# Altium schematic sheet MCU_Per.SchDoc
size A3
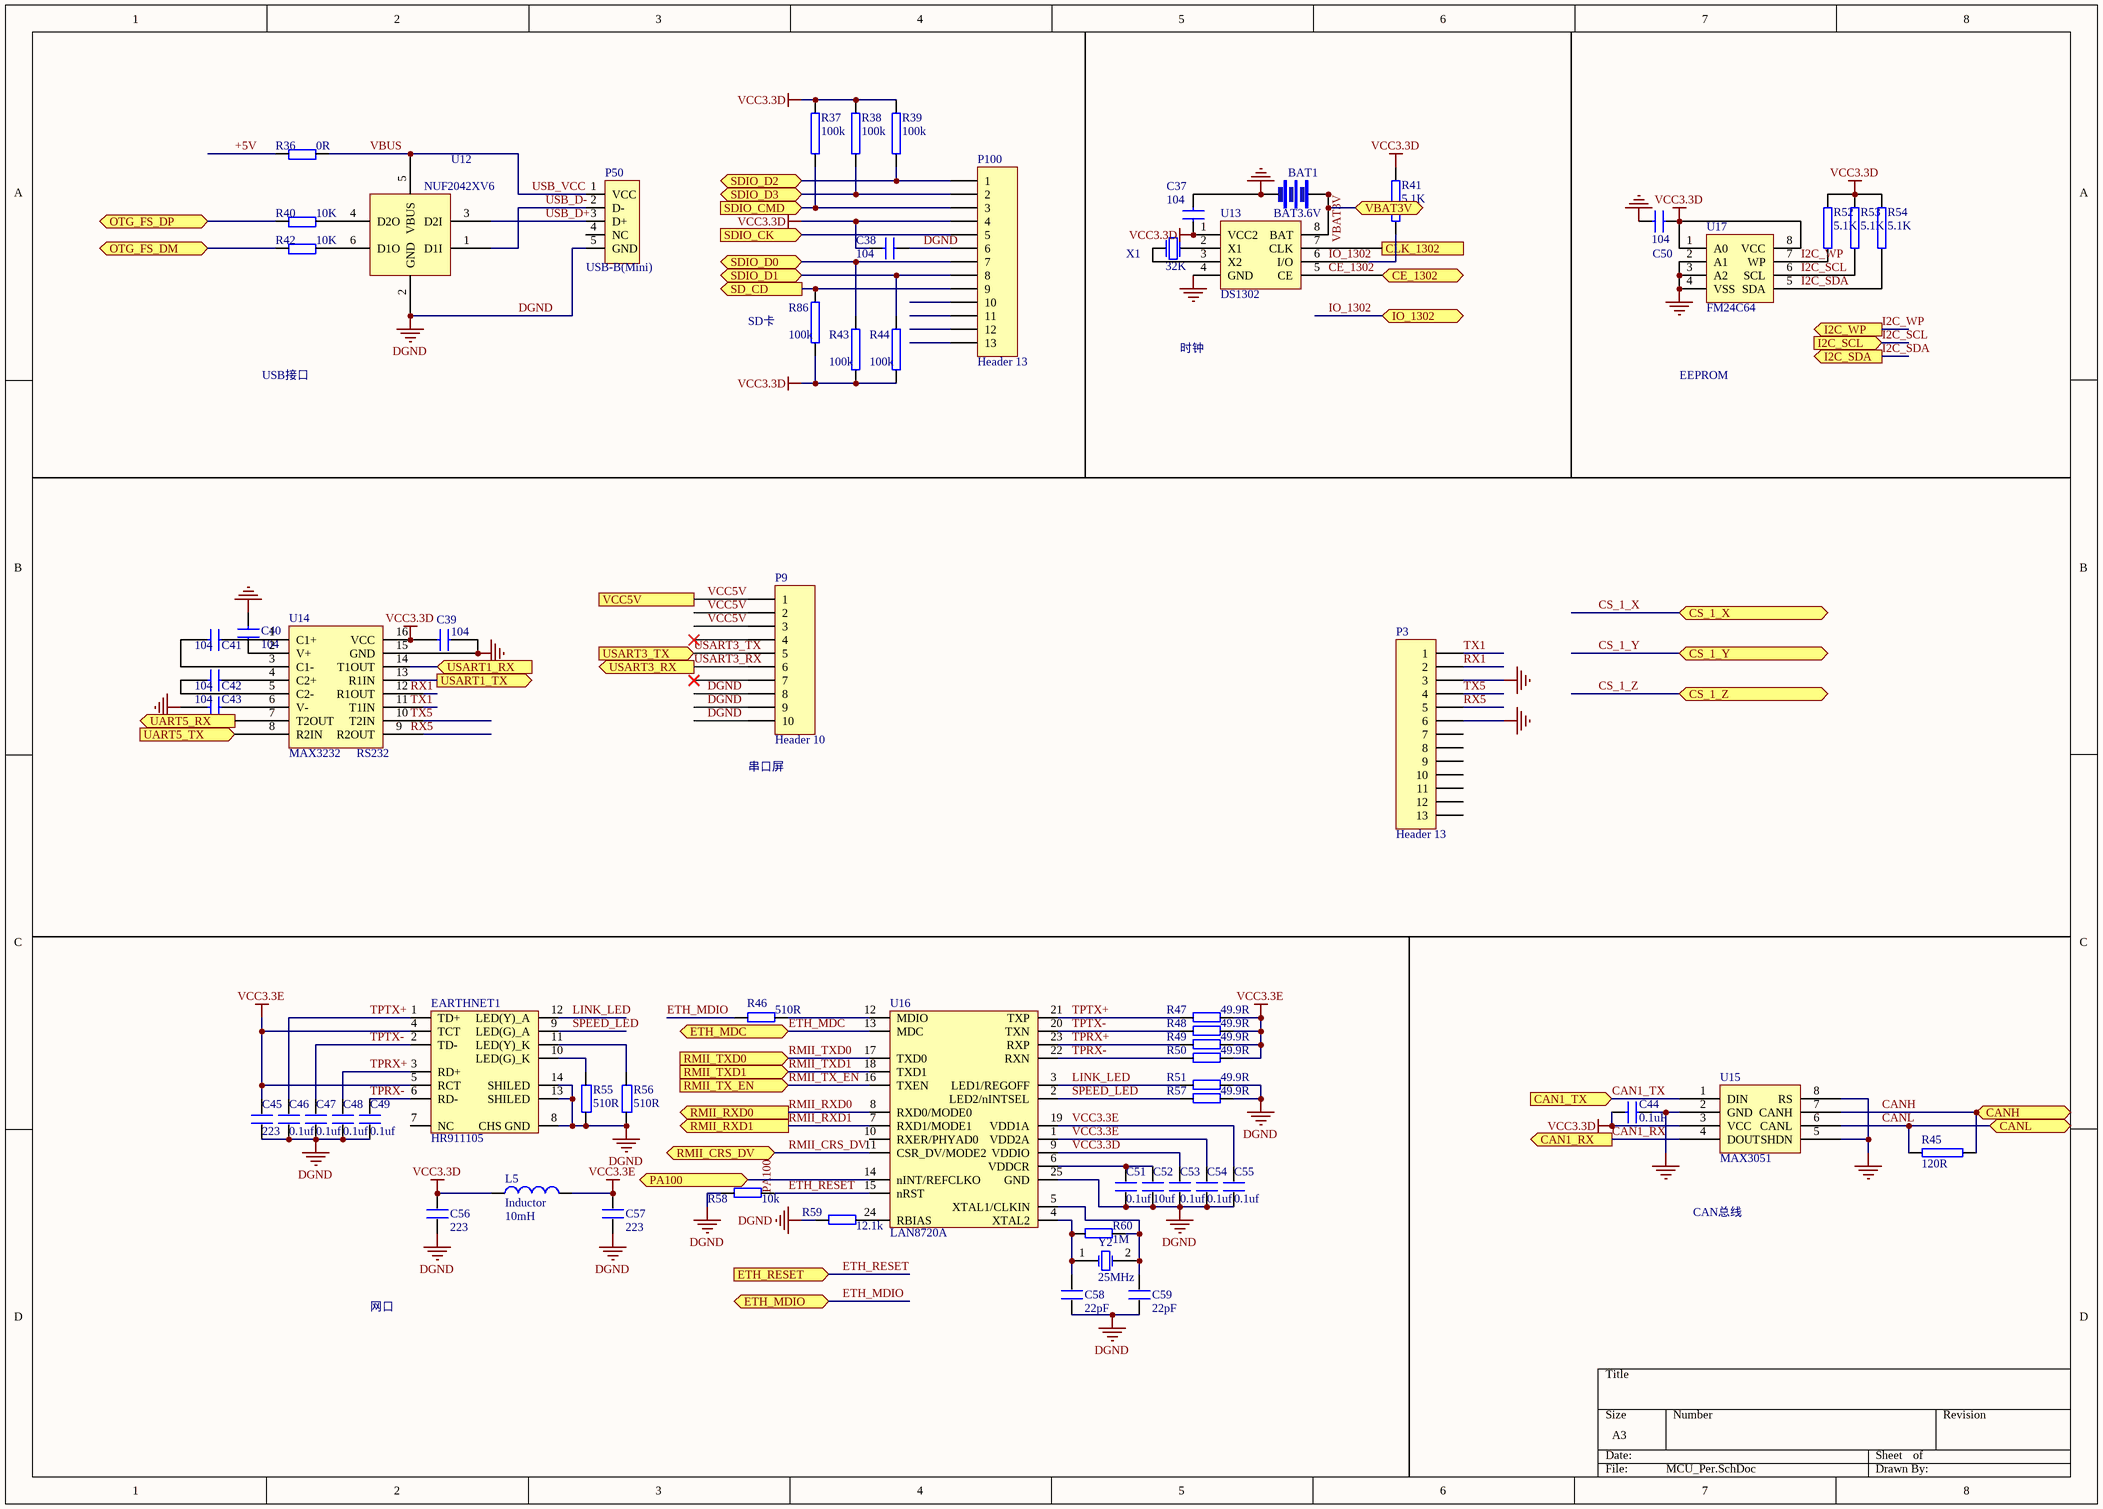
[diagram p0: MCU_Per.SchDoc]

## Parts
BAT1  BAT3.6V  [BAT]
C37  104  [0603]
C38  104  [0603]
C39  104  [0603]
C40  104  [0603]
C41  104  [0603]
C42  104  [0603]
C43  104  [0603]
C44  0.1uF  [0603]
C45  223  [0603P]
C46  0.1uf  [0603P]
C47  0.1uf  [0603P]
C48  0.1uf  [0603P]
C49  0.1uf  [0603P]
C50  104  [0603]
C51  0.1uf  [0603P]
C52  10uf  [0603P]
C53  0.1uf  [0603P]
C54  0.1uf  [0603P]
C55  0.1uf  [0603P]
C56  223  [0603P]
C57  223  [0603P]
C58  22pF  [0603P]
C59  22pF  [0603P]
EARTHNET1  HR911105  [HR911105A]
L5  Inductor  value 10mH  [0805]
P3  Header 13  [HDR1X6]
P9  Header 10  [PCBComponent_1]
P50  USB-B(Mini)  [USB/SM0.8-6H5]
P100  Header 13  [SD-SMT]
R36  0R  [0603P]
R37  100k  [0603]
R38  100k  [0603]
R39  100k  [0603]
R40  10K  [0603P]
R41  5.1K  [0603]
R42  10K  [0603P]
R43  100k  [0603]
R44  100k  [0603]
R45  120R  [0603]
R46  510R  [0603P]
R47  49.9R  [0603P]
R48  49.9R  [0603P]
R49  49.9R  [0603P]
R50  49.9R  [0603P]
R51  49.9R  [0603P]
R52  5.1K  [0603]
R53  5.1K  [0603]
R54  5.1K  [0603]
R55  510R  [0603P]
R56  510R  [0603P]
R57  49.9R  [0603P]
R58  10k  [0603P]
R59  12.1k  [0603P]
R60  1M  [0603P]
R86  100k  [0603]
U12  NUF2042XV6  [NUF2042XV6]
U13  DS1302  [SO-8]
U14  MAX3232  [SO-16]
U15  MAX3051  [SO-8]
U16  LAN8720A  [LAN7820A-QFN24]
U17  FM24C64  [SO-8]
X1  32K  [XTAL-2]
Y2  25MHz  [XTAL_US]

## Ports
CAN1_RX (out), CAN1_TX (in), CANH, CANL, CE_1302 (bidir), CLK_1302, CS_1_X, CS_1_Y, CS_1_Z, ETH_MDC (bidir), ETH_MDIO (bidir), ETH_RESET (in), I2C_SCL (in), I2C_SDA (out), I2C_WP (out), IO_1302 (bidir), OTG_FS_DM (bidir), OTG_FS_DP (bidir), PA100, RMII_CRS_DV (bidir), RMII_RXD0 (out), RMII_RXD1 (out), RMII_TX_EN (in), RMII_TXD0 (in), RMII_TXD1 (in), SD_CD (out), SDIO_CK (in), SDIO_CMD (in), SDIO_D0 (bidir), SDIO_D1 (bidir), SDIO_D2 (bidir), SDIO_D3 (bidir), UART5_RX (out), UART5_TX (in), USART1_RX (in), USART1_TX (out), USART3_RX (out), USART3_TX (in), VBAT3V, VCC5V

## Nets
DGND: BAT1.2 C37.1 C38.1 C39.1 C40.1 C43.2 C44.1 C45.2 C46.2 C47.2 C48.2 C49.2 C50.2 C51.2 C52.2 C53.2 C54.2 C55.2 C56.2 C57.2 C58.2 C59.2 EARTHNET1.8(CHS_GND) EARTHNET1.13(SHILED) EARTHNET1.14(SHILED) P3.3 P3.6 P9.8 P9.9 P9.10 P50.5(GND) P100.6 R51.1 R55.1 R56.1 R57.1 R58.2 R59.2 U12.2(GND) U13.4(GND) U14.15(GND) U15.2(GND) U15.5(SHDN) U15.8(RS) U16.25(GND) U17.2(A1) U17.3(A2) U17.4(VSS)
VCC3.3D: C37.2 C38.2 C39.2 C44.2 C50.1 C53.1 C56.1 L5.1 P100.4 R37.1 R38.1 R39.1 R41.2 R43.2 R44.2 R52.2 R53.2 R54.2 R86.2 U13.1(VCC2) U14.16(VCC) U15.3(VCC) U16.9(VDDIO) U17.1(A0) U17.8(VCC)
VCC3.3E: C45.1 C54.1 C55.1 C57.1 EARTHNET1.4(TCT) EARTHNET1.5(RCT) L5.2 R47.1 R48.1 R49.1 R50.1 U16.1(VDD2A) U16.19(VDD1A)
+5V: R36.1
CAN1_RX: U15.4(DOUT) ; port CAN1_RX
CAN1_TX: U15.1(DIN) ; port CAN1_TX
CANH: R45.1 U15.7(CANH) ; port CANH
CANL: R45.2 U15.6(CANL) ; port CANL
CE_1302: U13.5(CE) ; port CE_1302
CLK_1302: U13.7(CLK) ; port CLK_1302
CS_1_X: port CS_1_X
CS_1_Y: port CS_1_Y
CS_1_Z: port CS_1_Z
ETH_MDC: U16.13(MDC) ; port ETH_MDC
ETH_MDIO: R46.2 ; port ETH_MDIO
ETH_RESET: R58.1 U16.15(nRST) ; port ETH_RESET  [also labelled PA100]
I2C_SCL: R53.1 U17.6(SCL) ; port I2C_SCL
I2C_SDA: R54.1 U17.5(SDA) ; port I2C_SDA
I2C_WP: R52.1 U17.7(WP) ; port I2C_WP
IO_1302: R41.1 U13.6(I/O) ; port IO_1302
LINK_LED: EARTHNET1.12(LED(Y)_A) R51.2 U16.3(LED1/REGOFF)
OTG_FS_DM: R42.1 ; port OTG_FS_DM
OTG_FS_DP: R40.1 ; port OTG_FS_DP
PA100: U16.14(nINT/REFCLKO) ; port PA100
RMII_CRS_DV: U16.11(CSR_DV/MODE2) ; port RMII_CRS_DV
RMII_RXD0: U16.8(RXD0/MODE0) ; port RMII_RXD0
RMII_RXD1: U16.7(RXD1/MODE1) ; port RMII_RXD1
RMII_TX_EN: U16.16(TXEN) ; port RMII_TX_EN
RMII_TXD0: U16.17(TXD0) ; port RMII_TXD0
RMII_TXD1: U16.18(TXD1) ; port RMII_TXD1
RX1: P3.2 U14.12(R1OUT)
RX5: P3.5 U14.9(R2OUT)
SD_CD: P100.9 R86.1 ; port SD_CD
SDIO_CK: P100.5 ; port SDIO_CK
SDIO_CMD: P100.3 R37.2 ; port SDIO_CMD
SDIO_D0: P100.7 R43.1 ; port SDIO_D0
SDIO_D1: P100.8 R44.1 ; port SDIO_D1
SDIO_D2: P100.1 R39.2 ; port SDIO_D2
SDIO_D3: P100.2 R38.2 ; port SDIO_D3
SPEED_LED: EARTHNET1.9(LED(G)_A) R57.2 U16.2(LED2/nINTSEL)
TPRX+: C48.1 EARTHNET1.3(RD+) R49.2 U16.23(RXP)
TPRX-: C49.1 EARTHNET1.6(RD-) R50.2 U16.22(RXN)
TPTX+: C46.1 EARTHNET1.1(TD+) R47.2 U16.21(TXP)
TPTX-: C47.1 EARTHNET1.2(TD-) R48.2 U16.20(TXN)
TX1: P3.1 U14.11(T1IN)
TX5: P3.4 U14.10(T2IN)
UART5_RX: U14.7(T2OUT) ; port UART5_RX
UART5_TX: U14.8(R2IN) ; port UART5_TX
USART1_RX: U14.14(T1OUT) ; port USART1_RX
USART1_TX: U14.13(R1IN) ; port USART1_TX
USART3_RX: P9.6 ; port USART3_RX
USART3_TX: P9.5 ; port USART3_TX
USB_D+: P50.3(D+) U12.3(D2I)
USB_D-: P50.2(D-) U12.1(D1I)
USB_VCC: P50.1(VCC) R36.2 U12.5(VBUS)  [also labelled VBUS]
VBAT3V: BAT1.1 U13.8(BAT) ; port VBAT3V
VCC5V: P9.1 P9.2 P9.3 ; port VCC5V
NetC40_2: C40.2 U14.2(V+)
NetC41_1: C41.1 U14.1(C1+)
NetC41_2: C41.2 U14.3(C1-)
NetC42_1: C42.1 U14.4(C2+)
NetC42_2: C42.2 U14.5(C2-)
NetC43_1: C43.1 U14.6(V-)
NetC51_1: C51.1 C52.1 U16.6(VDDCR)
NetC58_1: C58.1 R60.2 U16.4(XTAL2) Y2.1(OSC1)
NetC59_1: C59.1 R60.1 U16.5(XTAL1/CLKIN) Y2.2(OSC2)
NetEARTHNET1_10: EARTHNET1.10(LED(G)_K) R55.2
NetEARTHNET1_11: EARTHNET1.11(LED(Y)_K) R56.2
NetR40_2: R40.2 U12.4(D2O)
NetR42_2: R42.2 U12.6(D1O)
NetR46_1: R46.1 U16.12(MDIO)
NetR59_1: R59.1 U16.24(RBIAS)
NetU13_2: U13.2(X1) X1.2(P2)
NetU13_3: U13.3(X2) X1.1(P1)

Not connected (* = marked no-connect by the designer): EARTHNET1 7(NC); P3 7 8 9 10 11 12 13; P9 4* 7*; P50 4(NC); P100 10 11 12 13; U16 10(RXER/PHYAD0)

## Notes on the sheet
- USB接口
- (near R86) SD卡
- 时钟
- EEPROM
- (near U14) RS232
- (near P9) 串口屏
- CAN总线
- 网口

## Library data of the parts
C37-C59 = C
L5 = Inductor: Code_IEC: 1005; Published: 8-Jun-2000; LatestRevisionDate: 29-May-2009; LatestRevisionNote: IPC-7351 Footprint Added.; PackageReference: 0402-A; Publisher: Altium Limited; PackageDescription: Chip Inductor; Code_JEITA: 0402
P3 P100 = Header 13: Header, 13-Pin; LatestRevisionDate: 17-Jul-2002; LatestRevisionNote: Re-released for DXP Platform.; Publisher: Altium Limited
P9 = Header 10: Header, 10-Pin; LatestRevisionDate: 17-Jul-2002; LatestRevisionNote: Re-released for DXP Platform.; Publisher: Altium Limited
P50 = USB5
R36 R40 R42 R46-R51 R55-R60 = R
R37-R39 R41 R43-R45 R52-R54 R86 = RES
U12 = NUF2042XV6: USB
U15 = MAX3051: CAN
U16 = LAN8720: ETH PHY
X1 = XTAL
Y2 = XTAL: Crystal Oscillator; Published: 8-Jun-2000; LatestRevisionDate: 17-Jul-2002; LatestRevisionNote: Re-released for DXP Platform.; PackageReference: R38; Publisher: Altium Limited; PackageDescription: Crystal, Thru-Hole; 2 Leads; Body 3.1 x 8.2 mm (Dia.xH)